# EAGLE design bee_shield_template (EAGLE 5.11)
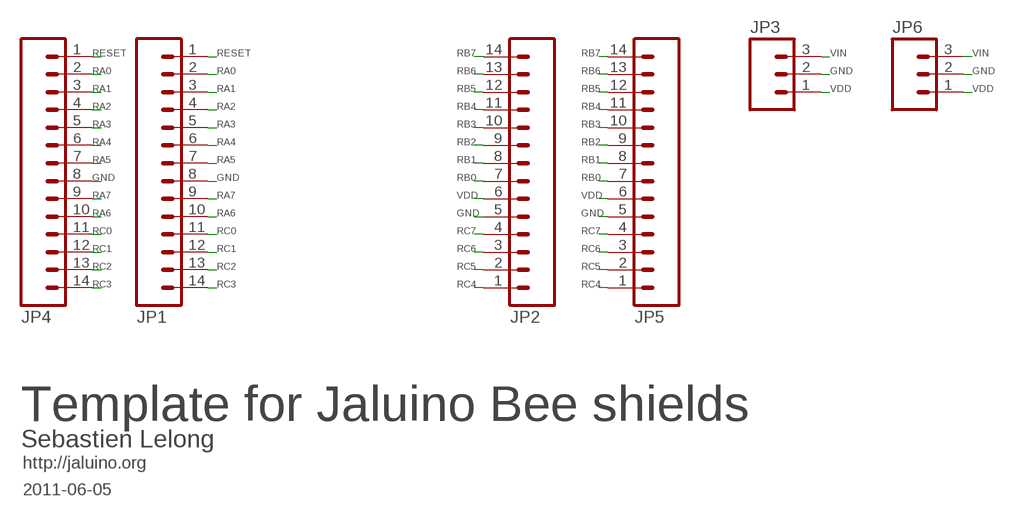
[diagram p0: schematic, sheet 1]

## Parts
JP1  M14  [1X14]
JP2  M14  [1X14]
JP3  M03PTH  [1X03]
JP4  M14  [1X14]
JP5  M14  [1X14]
JP6  M03PTH  [1X03]

## Nets
GND: JP1.8 JP2.5 JP3.2 JP4.8 JP5.5 JP6.2
RA0: JP1.2 JP4.2
RA1: JP1.3 JP4.3
RA2: JP1.4 JP4.4
RA3: JP1.5 JP4.5
RA4: JP1.6 JP4.6
RA5: JP1.7 JP4.7
RA6: JP1.10 JP4.10
RA7: JP1.9 JP4.9
RB0: JP2.7 JP5.7
RB1: JP2.8 JP5.8
RB2: JP2.9 JP5.9
RB3: JP2.10 JP5.10
RB4: JP2.11 JP5.11
RB5: JP2.12 JP5.12
RB6: JP2.13 JP5.13
RB7: JP2.14 JP5.14
RC0: JP1.11 JP4.11
RC1: JP1.12 JP4.12
RC2: JP1.13 JP4.13
RC3: JP1.14 JP4.14
RC4: JP2.1 JP5.1
RC5: JP2.2 JP5.2
RC6: JP2.3 JP5.3
RC7: JP2.4 JP5.4
RESET: JP1.1 JP4.1
VDD: JP2.6 JP3.1 JP5.6 JP6.1
VIN: JP3.3 JP6.3

## Notes on the sheet
- Template for Jaluino Bee shields
- Sebastien Lelong
- http://jaluino.org
- 2011-06-05

## Library data of the parts
JP1 JP2 JP4 JP5 = SparkFun:M14: Header 14 Standard 14-pin 0.1" header. Use with straight break away headers (SKU : PRT-00116), right angle break away headers (PRT-00553), swiss pins (PRT-00743), machine pins (PRT-00117), and female headers (PRT-00115).
JP3 JP6 = SparkFun:M03: Header 3 Standard 3-pin 0.1" header. Use with straight break away headers (SKU : PRT-00116), right angle break away headers (PRT-00553), swiss pins (PRT-00743), machine pins (PRT-00117), and female headers (PRT-00115). Molex polarized connector foot print use with SKU : PRT-08232 with associated crimp pins and housings.

## Board
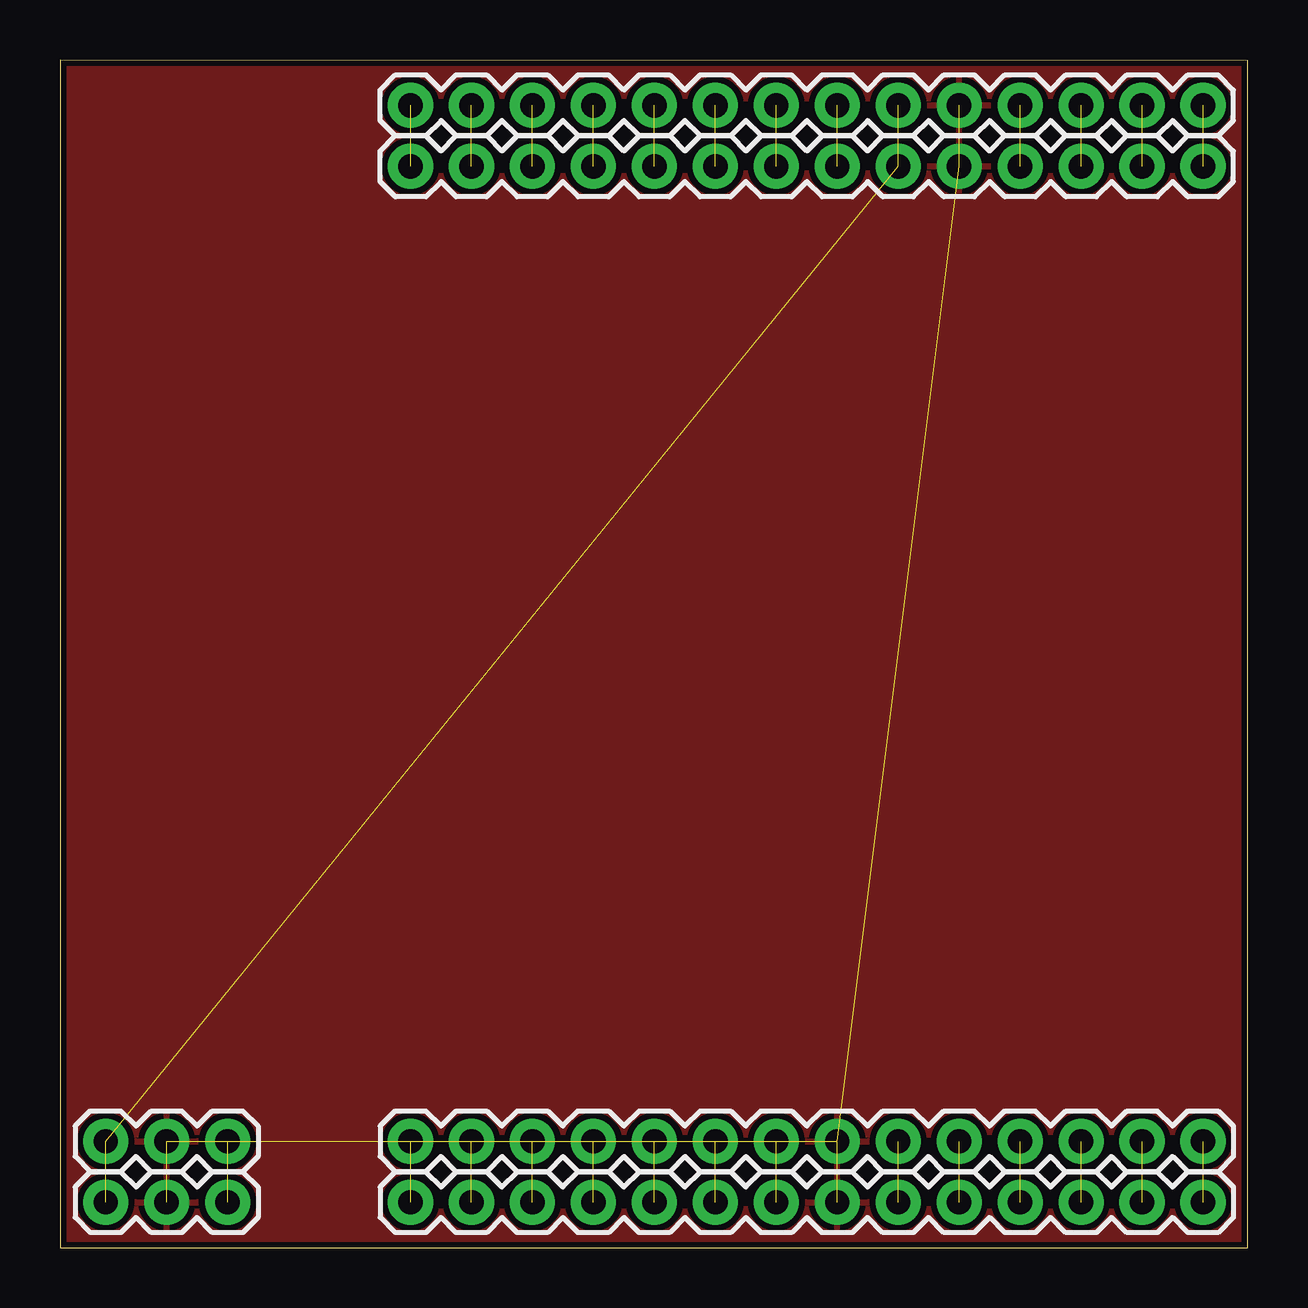
[diagram p1: board, top side]
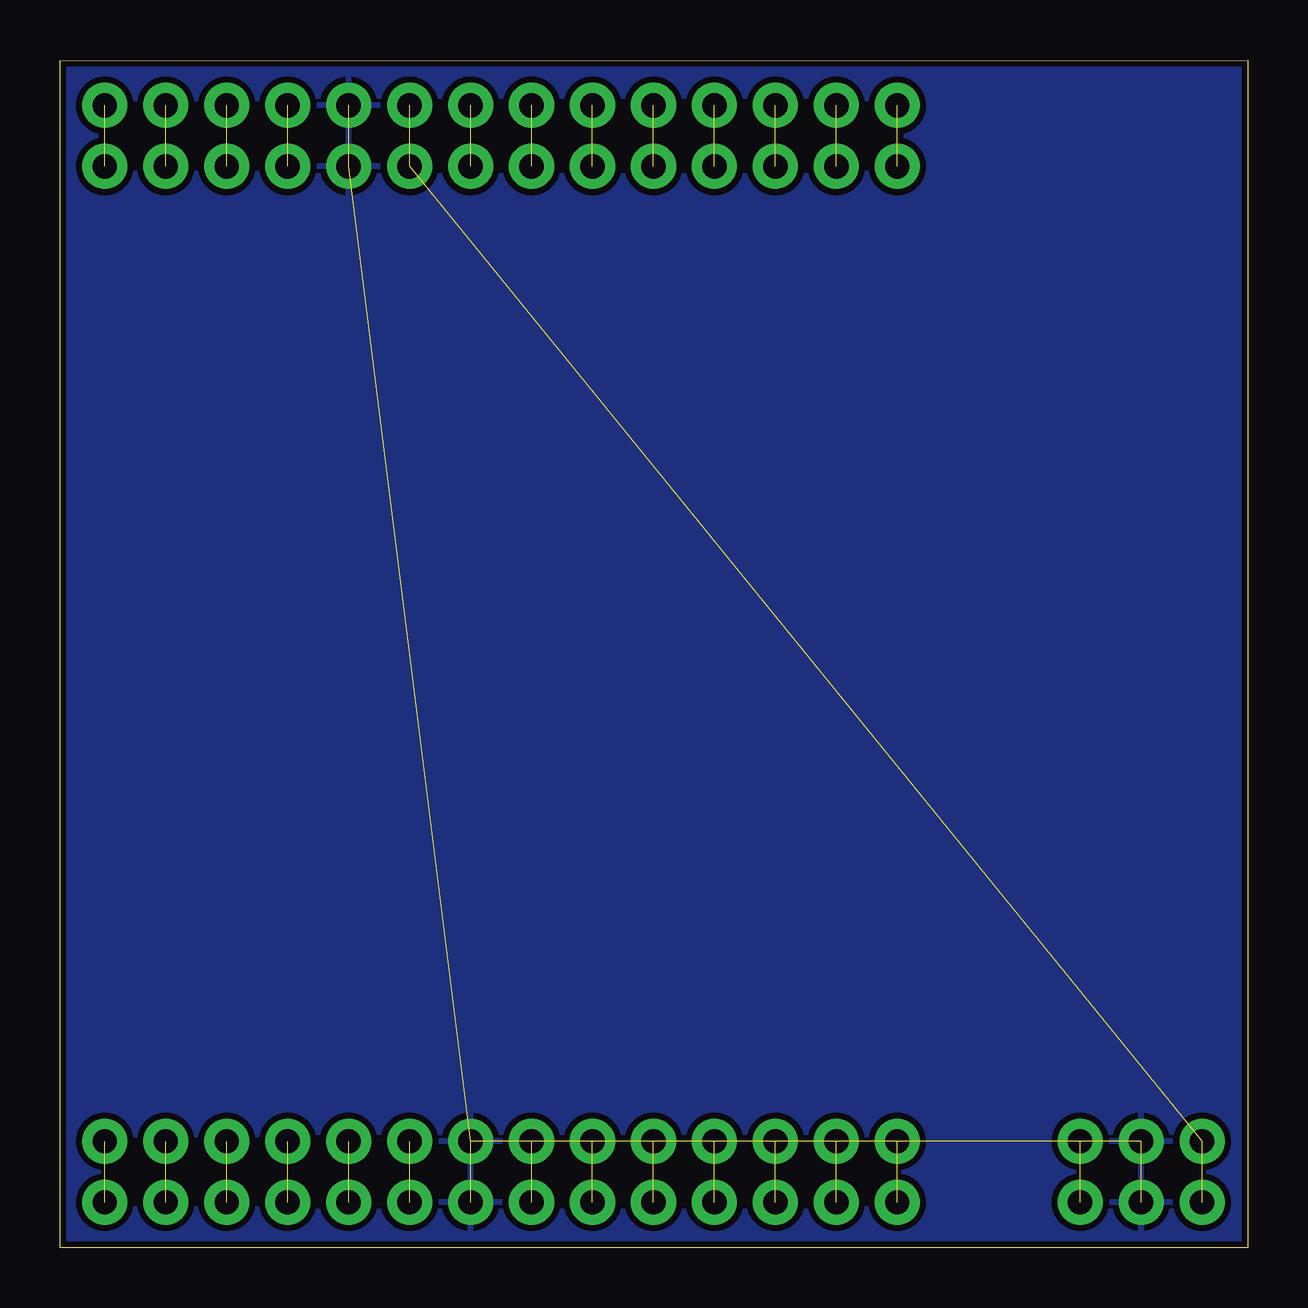
[diagram p2: board, bottom side, seen from below]

Size 49.49 x 49.52 mm. Coordinates in mm from the lower left corner, seen from the top.
Outline: 0,0 49.49,0 49.49,49.49 0,49.52 0,0
Copper layers (1*16): Top 0.035mm / dielectric 1.5mm / Bottom 0.035mm
Design rules "bee_itead_10mil": minimum track width 10mil, minimum drill 12mil, track to track 10mil, track to pad 10mil, pad to pad 10mil, via to via 10mil, smd to smd 0mil, copper to edge 10mil, drill to drill 10mil, minimum pad ring 10mil, minimum via ring 8mil, stop-mask expansion 2mil, vias tented up to drill 100mil, thermal gap 10mil

### Footprints (pad centres in the part's own frame; a part is rotated, then mirrored left to right if it is on the bottom)
1X14 = drill 1.016 pad 1.88 round: 1 0,0; 2 2.54,0; 3 5.08,0; 4 7.62,0; 5 10.16,0; 6 12.7,0; 7 15.24,0; 8 17.78,0; 9 20.32,0; 10 22.86,0; 11 25.4,0; 12 27.94,0; 13 30.48,0; 14 33.02,0
1X03 = drill 1.016 pad 1.88 round: 1 0,0; 2 2.54,0; 3 5.08,0

### Placement (x,y rotation side)
JP1  14.61,1.91 0 top
JP2  47.62,45.09 180 top
JP3  1.91,1.91 0 top
JP4  14.61,4.45 0 top
JP5  47.62,47.62 180 top
JP6  1.91,4.45 0 top

### Tracks (layer width: path | path; a pad name or v marks a point on that pad's centre or on a via)
GND  (5 unrouted)
  pour Top (isolate 0.254): 0,49.53 49.53,49.53 49.53,0 0,0
  pour Bottom (isolate 0.254): 0,49.53 49.53,49.53 49.53,0 0,0
RA0  (1 unrouted)
RA1  (1 unrouted)
RA2  (1 unrouted)
RA3  (1 unrouted)
RA4  (1 unrouted)
RA5  (1 unrouted)
RA6  (1 unrouted)
RA7  (1 unrouted)
RB0  (1 unrouted)
RB1  (1 unrouted)
RB2  (1 unrouted)
RB3  (1 unrouted)
RB4  (1 unrouted)
RB5  (1 unrouted)
RB6  (1 unrouted)
RB7  (1 unrouted)
RC0  (1 unrouted)
RC1  (1 unrouted)
RC2  (1 unrouted)
RC3  (1 unrouted)
RC4  (1 unrouted)
RC5  (1 unrouted)
RC6  (1 unrouted)
RC7  (1 unrouted)
RESET  (1 unrouted)
VDD  (3 unrouted)
VIN  (1 unrouted)